# EAGLE schematic 9led-module (EAGLE 6.0)
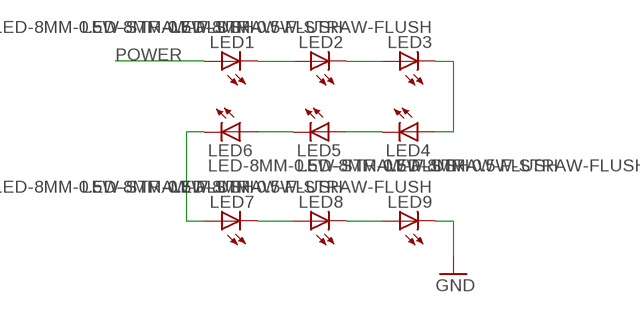
[diagram p0: schematic, sheet 1]

## Parts
LED1  LED-8MM-0.5W-STRAW-FLUSH  [LED-8MM-0.5W-FLUSH]
LED2  LED-8MM-0.5W-STRAW-FLUSH  [LED-8MM-0.5W-FLUSH]
LED3  LED-8MM-0.5W-STRAW-FLUSH  [LED-8MM-0.5W-FLUSH]
LED4  LED-8MM-0.5W-STRAW-FLUSH  [LED-8MM-0.5W-FLUSH]
LED5  LED-8MM-0.5W-STRAW-FLUSH  [LED-8MM-0.5W-FLUSH]
LED6  LED-8MM-0.5W-STRAW-FLUSH  [LED-8MM-0.5W-FLUSH]
LED7  LED-8MM-0.5W-STRAW-FLUSH  [LED-8MM-0.5W-FLUSH]
LED8  LED-8MM-0.5W-STRAW-FLUSH  [LED-8MM-0.5W-FLUSH]
LED9  LED-8MM-0.5W-STRAW-FLUSH  [LED-8MM-0.5W-FLUSH]

## Nets
GND: LED9.P$2(C)
N$1: LED1.P$2(C) LED2.P$1(A)
N$2: LED2.P$2(C) LED3.P$1(A)
N$3: LED3.P$2(C) LED4.P$1(A)
N$4: LED4.P$2(C) LED5.P$1(A)
N$5: LED5.P$2(C) LED6.P$1(A)
N$6: LED6.P$2(C) LED7.P$1(A)
N$7: LED7.P$2(C) LED8.P$1(A)
N$8: LED8.P$2(C) LED9.P$1(A)
POWER: LED1.P$1(A)

## Library data of the parts
LED1-LED9 = led-8mm-0.5w:LED-8MM-0.5W-STRAW: 8mm 0.5w power led, wide angle straw hat. Flush footprint to make leds sit flush with pcb. by Anton Veretenenko <anton@veretenenko.ru>